# Altium project Machsackhongday.PrjPcb
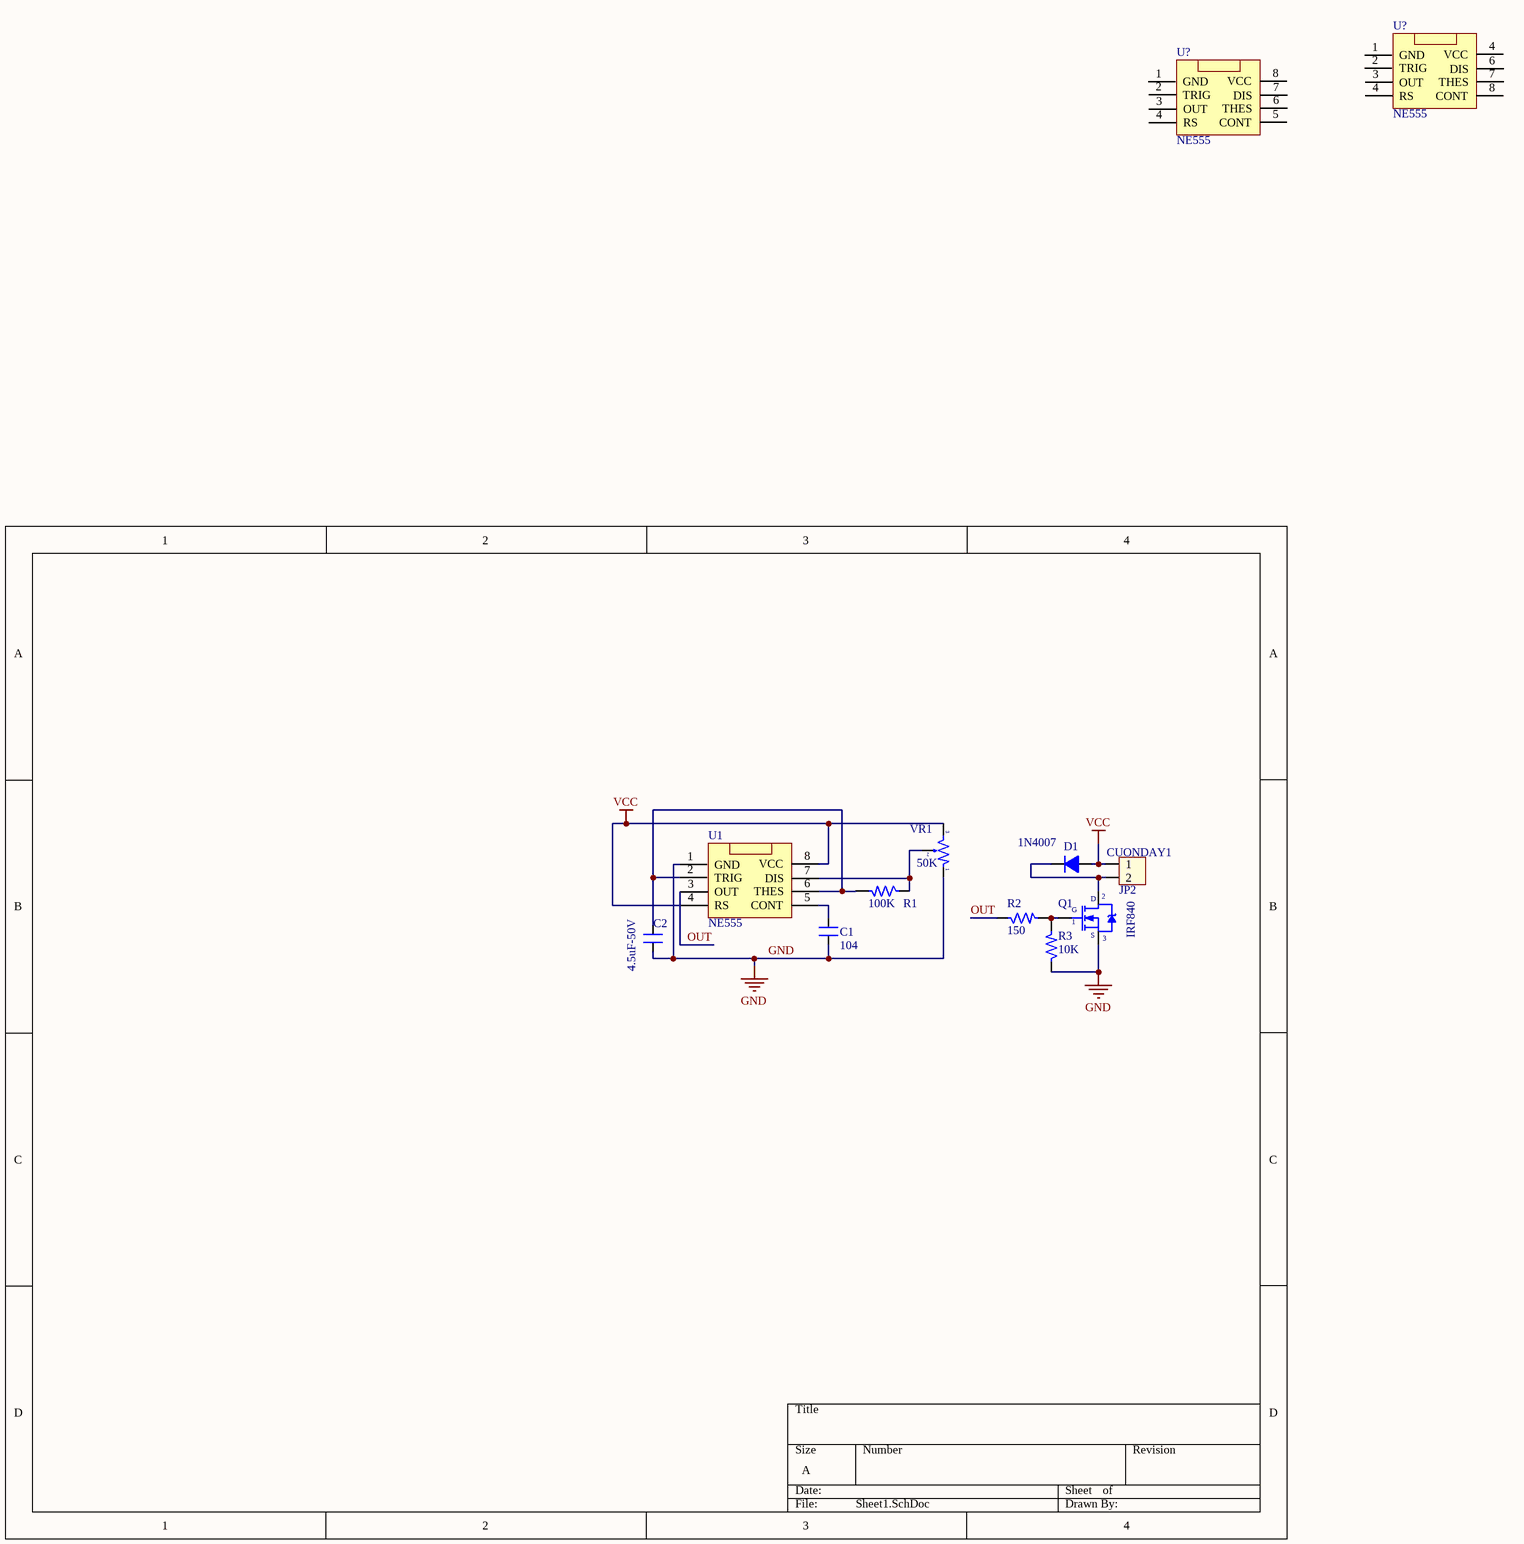
[diagram p0: Sheet1.SchDoc]
1 sheet, 12 parts. Net scope: global (net labels, ports and power ports of the same name join across sheets).

## Sheet Sheet1.SchDoc
size A

### Parts
(Parts that share a designator on the sheet are numbered #1, #2 ... from top to bottom, then left to right.)
C1  104  [SM-1206]
C2  4.5uF-50V  [CP1/2]
CUONDAY1  JP2  [CON2]
D1  1N4007  [D1A]
Q1  IRF840  [QTO-220]
R1  100K  [SM-0805]
R2  150  [SM-0805]
R3  10K  [SM-0805]
U1  NE555  [NE555-SMD]
U?#1  NE555  [NE555]
U?#2  NE555  [NE555]
VR1  50K  [VOL-S]

### Nets
GND: C1.1 C2.1 Q1.3(S) R3.1 U1.1(GND) VR1.1
OUT: CUONDAY1.1 D1.1(A) R2.1 U1.3(OUT) U1.4(RS) U1.8(VCC) VR1.3  [also labelled VCC]
NetC1_2: C1.2 U1.5(CONT)
NetC2_2: C2.2 R1.2 U1.2(TRIG) U1.6(THES)
NetCUONDAY1_2: CUONDAY1.2 D1.2(K) Q1.2(D)
NetQ1_1: Q1.1(G) R2.2 R3.2
NetR1_1: R1.1 U1.7(DIS) VR1.2

Not connected (* = marked no-connect by the designer): U?#1 1(GND) 2(TRIG) 3(OUT) 4(RS) 6(DIS) 7(THES) 8(CONT); U?#2 1(GND) 2(TRIG) 3(OUT) 4(RS) 5(CONT) 6(THES) 7(DIS) 8(VCC)

### Library data of the parts
C1 C2 = CM: Cap SMD; Value: 103
CUONDAY1 = Con2: Connector 2; Value: Connector 2
D1 = D1A: Diode 1A; Value: 1N4007
Q1 = IRF840: MOSFET N - CHANNEL 500V - 0.75 - 8A - TO-220; Value: IRF840
R1-R3 = R: Resistor 1/4W; Value: R1/4W - 1K
VR1 = VOL-S: Var Resistor; Value: Volume 50k